# Altium schematic sheet LM25088QMH-2_NOPB_2022-06-29.schdoc
size 54 x 48 mm
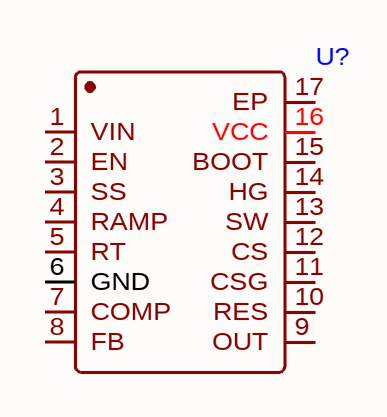
[diagram p0: LM25088QMH-2_NOPB_2022-06-29.schdoc]

## Parts
U?  (no value)  [HTSSOP-16_L5.0-W4.4-P0.65-LS6.4-BL-EP]

## Nets

Not connected (* = marked no-connect by the designer): U? 1(VIN) 2(EN) 3(SS) 4(RAMP) 5(RT) 6(GND) 7(COMP) 8(FB) 9(OUT) 10(RES) 11(CSG) 12(CS) 13(SW) 14(HG) 15(BOOT) 16(VCC) 17(EP)

## Library data of the parts
U? = LM25088QMH-2/NOPB